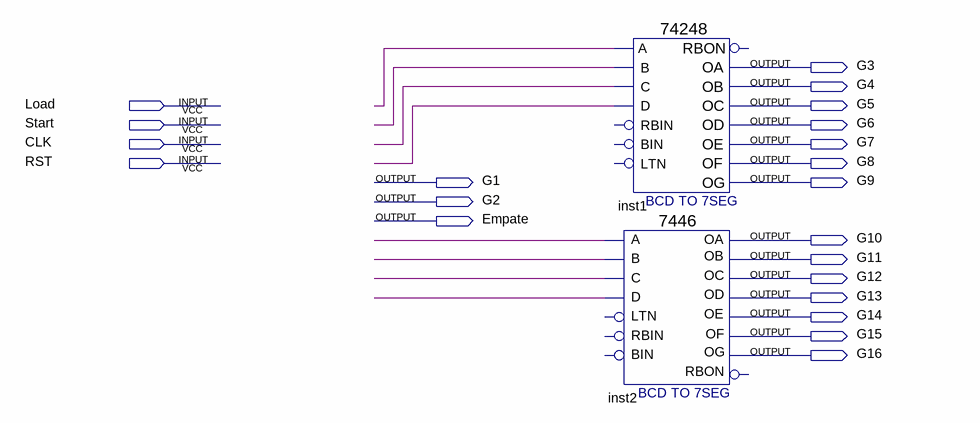
[diagram p0: schematic sheet]
// Quartus schematic Completo.bdf as structural Verilog: 2 symbols, 21 pins
module Completo (
  input  Load,
  input  Start,
  input  CLK,
  input  RST,
  output G3,
  output G4,
  output G5,
  output G6,
  output G7,
  output G8,
  output G1,
  output G9,
  output G2,
  output Empate,
  output G10,
  output G11,
  output G12,
  output G13,
  output G14,
  output G15,
  output G16
);

  wire undriven, undriven_2, undriven_3, undriven_4, undriven_5, undriven_6, undriven_7, undriven_8;

  \74248  inst1 (
    .A(undriven), .B(undriven_2), .D(undriven_4), .C(undriven_3), .OG(G9), .OD(G6), .OE(G7), .OF(G8),
    .OA(G3), .OB(G4), .OC(G5));  // open: RBIN, LTN, BIN, RBON
  \7446  inst2 (
    .D(undriven_5), .C(undriven_6), .B(undriven_7), .A(undriven_8), .OC(G12), .OD(G13), .OE(G14), .OA(G10),
    .OB(G11), .OF(G15), .OG(G16));  // open: LTN, RBIN, BIN, RBON
endmodule
